# EAGLE design latch_THT_v2 (EAGLE 8.3.1)
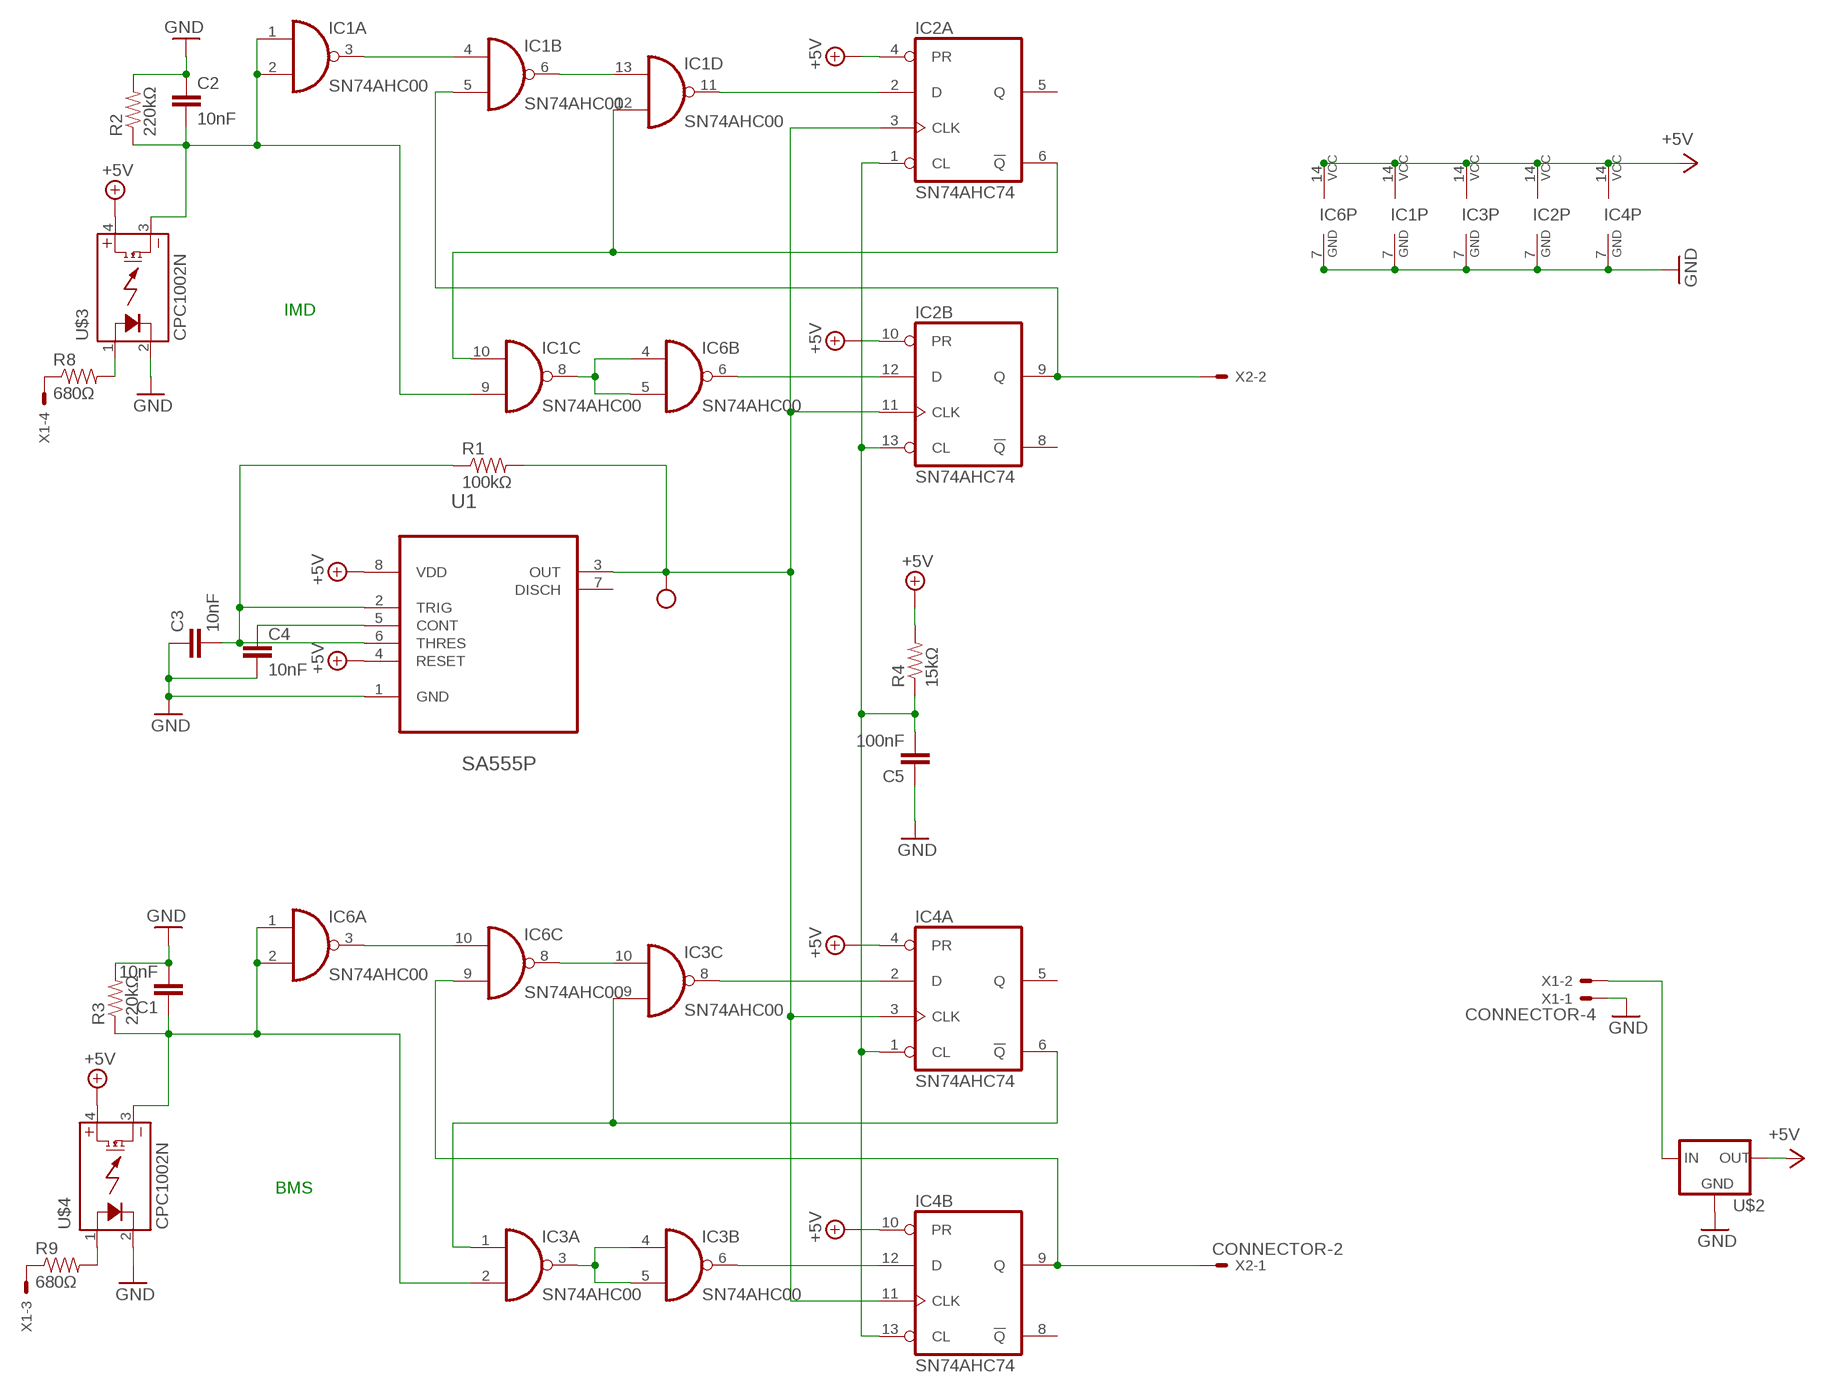
[diagram p0: schematic, sheet 1]

## Parts
C1  10nF  CAP_  [AXIAL-5MM]
C2  10nF  CAP_  [AXIAL-5MM]
C3  10nF  CAP_  [AXIAL-5MM]
C4  10nF  CAP_  [AXIAL-5MM]
C5  100nF  CAP_  [AXIAL-5MM]
IC1  SN74AHC00  [DIL14]
IC2  SN74AHC74  [DIL14]
IC3  SN74AHC00  [DIL14]
IC4  SN74AHC74  [DIL14]
IC6  SN74AHC00  [DIL14]
R1  100kΩ  RESISTORPTH-1/4W  [AXIAL-0.4]
R2  220kΩ  RESISTORPTH-1/4W  [AXIAL-0.4]
R3  220kΩ  RESISTORPTH-1/4W  [AXIAL-0.4]
R4  15kΩ  RESISTORPTH-1/4W  [AXIAL-0.4]
R8  680Ω  RESISTORPTH-1/4W  [AXIAL-0.4]
R9  680Ω  RESISTORPTH-1/4W  [AXIAL-0.4]
U1  SA555P  [DIP254P762X508-8]
U$1  TEST_POINT  [TEST_POINT]
U$2  5VREG_LM340-NLM340T-5.0/NOPB  [TO-220]
U$3  CPC1002N  [SOP04]
U$4  CPC1002N  [SOP04]
X1  CONNECTOR-4  [MINIFIT_5566-4]
X2  CONNECTOR-2  [MINIFIT_5566-2]

## Nets
12V: U$2.1(IN) X1.2
+5V: IC1.14(P:VCC) IC2.4(A:PR) IC2.10(B:PR) IC2.14(P:VCC) IC3.14(P:VCC) IC4.4(A:PR) IC4.10(B:PR) IC4.14(P:VCC) IC6.14(P:VCC) R4.P$2 U1.4(RESET) U1.8(VDD) U$2.3(OUT) U$3.4(DC+) U$4.4(DC+)
BMS_5V: C1.P$1 IC3.2(A:I1) IC6.1(A:I0) IC6.2(A:I1) R3.P$1 U$4.3(DC-)
BMS_IN: R9.P$2 U$4.1(CONTROL+)
BMS_OUT: IC4.9(B:Q) IC6.9(C:I1) X2.1
CLK: IC2.3(A:CLK) IC2.11(B:CLK) IC4.3(A:CLK) IC4.11(B:CLK) R1.P$2 U1.3(OUT) U$1.P$1
GND: C1.P$2 C2.P$1 C3.P$1 C4.P$2 C5.P$1 IC1.7(P:GND) IC2.7(P:GND) IC3.7(P:GND) IC4.7(P:GND) IC6.7(P:GND) R2.P$2 R3.P$2 U1.1(GND) U$2.2(GND) U$3.2(CONTROL-) U$4.2(CONTROL-) X1.1
IMD_5V: C2.P$2 IC1.1(A:I0) IC1.2(A:I1) IC1.9(C:I1) R2.P$1 U$3.3(DC-)
IMD_IN: R8.P$2 U$3.1(CONTROL+)
IMD_OUT: IC1.5(B:I1) IC2.9(B:Q) X2.2
N$1: C5.P$2 IC2.1(A:CL) IC2.13(B:CL) IC4.1(A:CL) IC4.13(B:CL) R4.P$1
N$2: IC1.3(A:O) IC1.4(B:I0)
N$3: C3.P$2 R1.P$1 U1.2(TRIG) U1.6(THRES)
N$4: IC1.6(B:O) IC1.13(D:I0)
N$5: IC1.10(C:I0) IC1.12(D:I1) IC2.6(A:!Q)
N$6: IC1.11(D:O) IC2.2(A:D)
N$7: C4.P$1 U1.5(CONT)
N$8: IC2.12(B:D) IC6.6(B:O)
N$10: IC3.6(B:O) IC4.12(B:D)
N$11: IC1.8(C:O) IC6.4(B:I0) IC6.5(B:I1)
N$20: IC6.3(A:O) IC6.10(C:I0)
N$21: IC3.10(C:I0) IC6.8(C:O)
N$22: IC3.1(A:I0) IC3.9(C:I1) IC4.6(A:!Q)
N$23: IC3.8(C:O) IC4.2(A:D)
N$25: IC3.3(A:O) IC3.4(B:I0) IC3.5(B:I1)
N$32: R8.P$1 X1.4
N$33: R9.P$1 X1.3
Unconnected: IC2.5(A:Q) IC2.8(B:!Q) IC3.11(D:O) IC3.12(D:I1) IC3.13(D:I0) IC4.5(A:Q) IC4.8(B:!Q) IC6.11(D:O) IC6.12(D:I1) IC6.13(D:I0) U1.7(DISCH)

## Notes on the sheet
- IMD
- BMS

## Library data of the parts
C1-C5 = HyTechDevices:CAP: Capacitor Standard 0603 ceramic capacitor, and 0.1" leaded capacitor.
IC1 IC3 IC6 = HyTechDevices:SN74AHC00: TI SN74AHC00 Quadruple 2-input NAND
IC2 IC4 = HyTechDevices:SN74AHC74: TI SN74AHC74 Dual positive edge triggered D-type FLIP FLOP
R1-R4 R8 R9 = HyTechDevices:RESISTOR: Resistor Basic schematic elements and footprints for 0603, 1206, and PTH resistors.
U1 = Texas Instruments:SA555P: PRECISION TIMERS; MPN: SA555P; OC_FARNELL: 1755013; OC_NEWARK: 08F4502; PACKAGE: PDIP-8; SUPPLIER: Texas Instruments
U$1 = HyTechDevices:TEST_POINT: Keystone Electronics Test Point 5005
U$2 = HyTechDevices:5VREG_LM340-N: Voltage Regulator 5v linear voltage regulator Datasheet <http://www.mouser.com/ProductDetail/Texas-Instruments/LM340MPX-50-NOPB/?qs=X1J7HmVL2ZGZwtTFRQ9ItA%3D%3D> MAX current out: 1.5A MAX voltage in: 35V
U$3 U$4 = HyTechDevices:CPC1002N: IXYS Solid State Relay .7A
X1 = HyTechDevices:CONNECTOR-4: Mini-Fit Junior connector 4 pole Source: http://www.molex.com; OC_FARNELL: unknown; OC_NEWARK: unknown
X2 = HyTechDevices:CONNECTOR-2: Mini-Fit Junior connector 2 pole Source: http://www.molex.com; OC_FARNELL: 1822072; OC_NEWARK: unknown

## Net classes
0 default: width 0.406 mm, drill 0.406 mm, clearance 0.406 mm

## Board
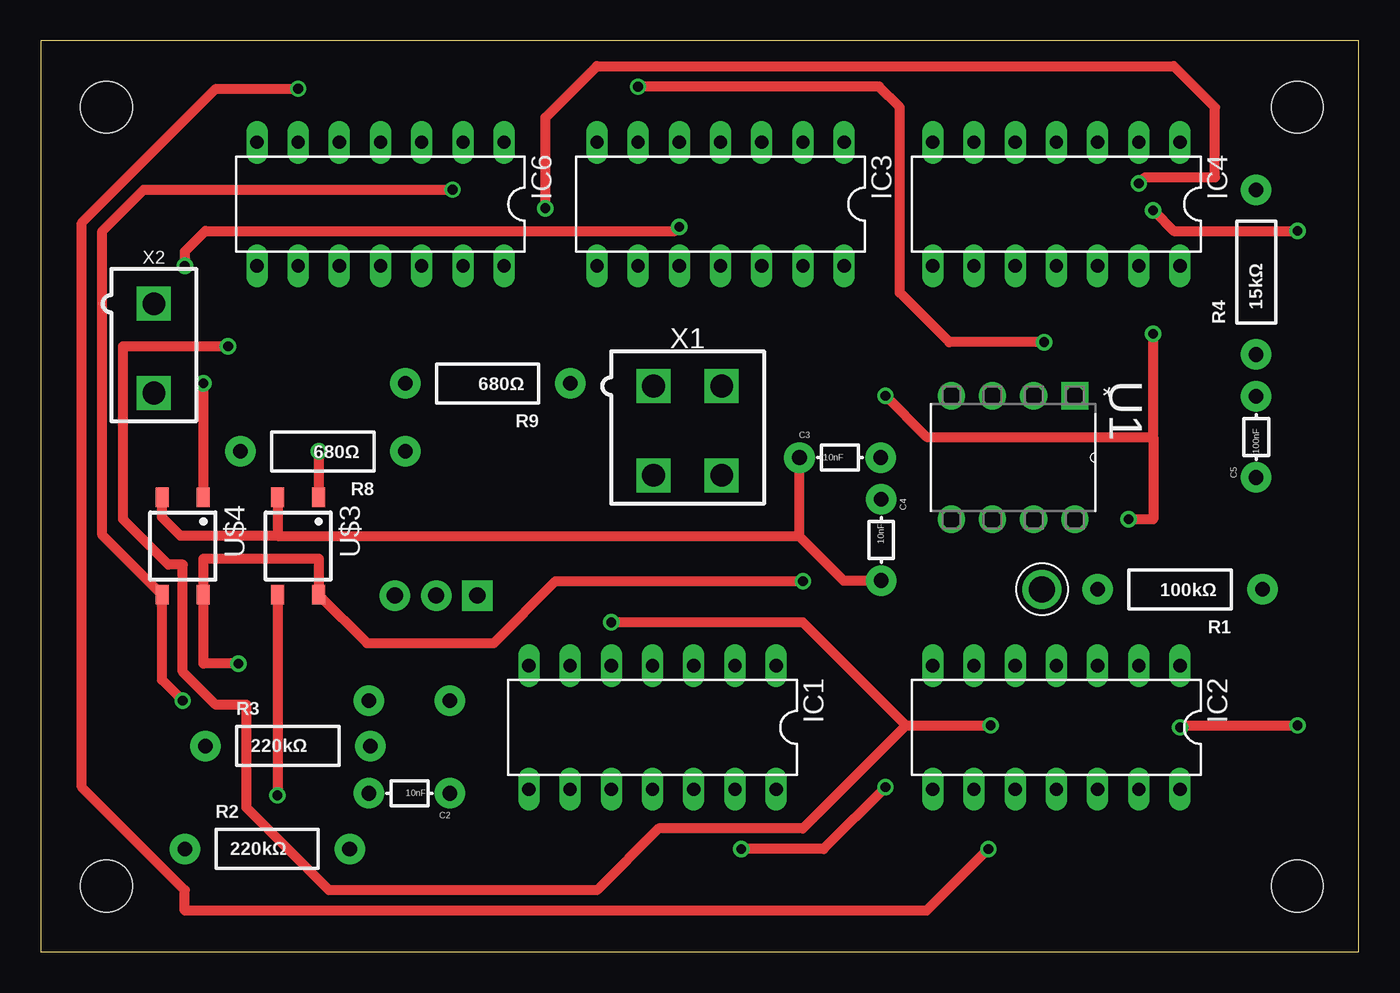
[diagram p1: board, top side]
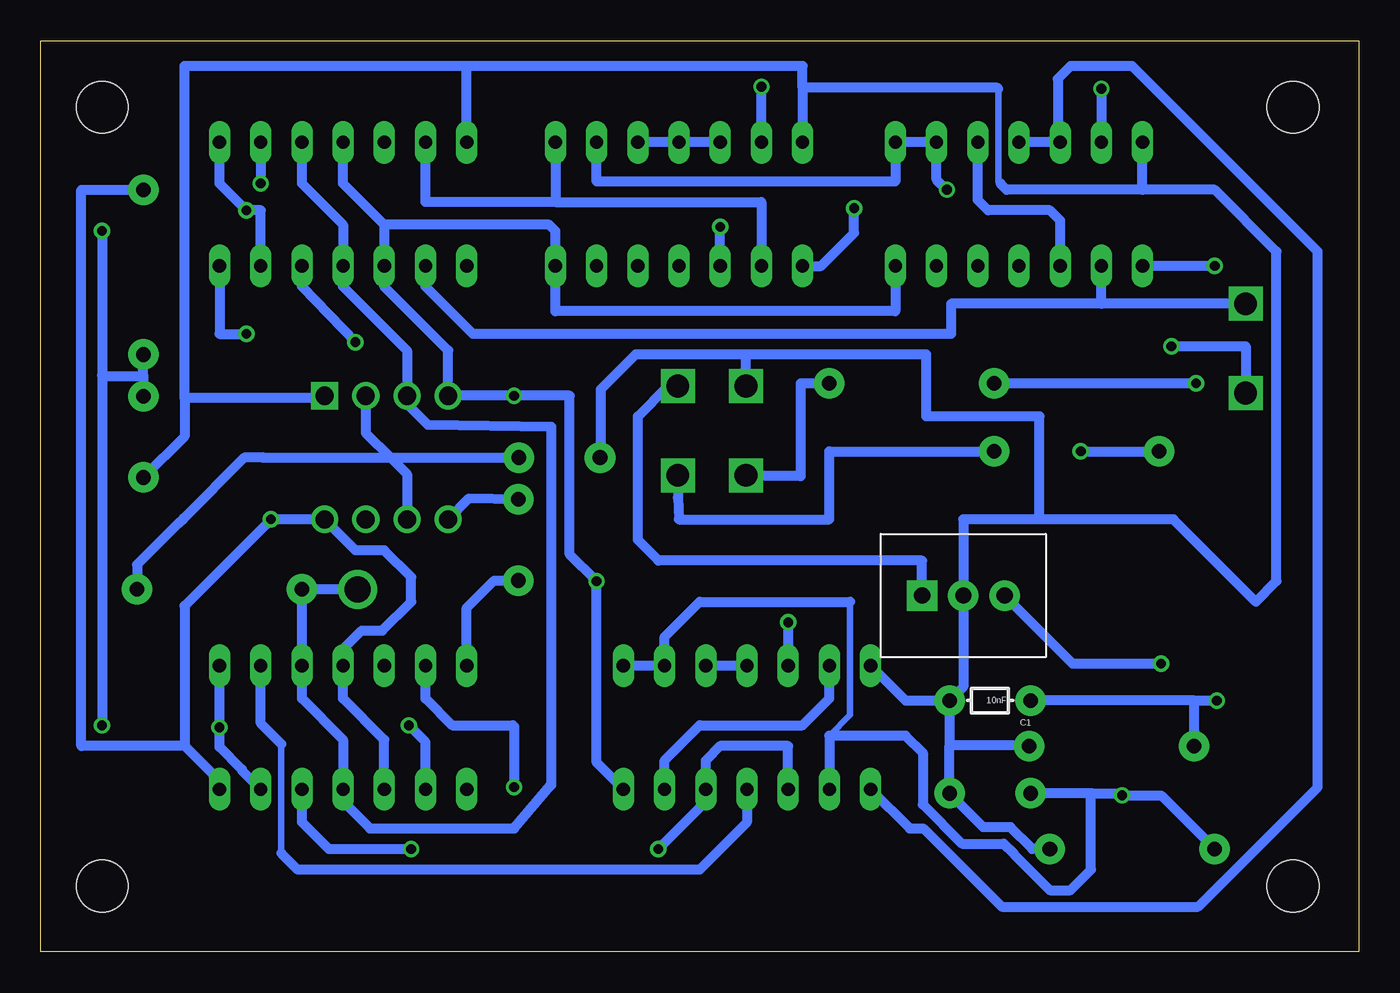
[diagram p2: board, bottom side, seen from below]

Size 81.26 x 56.19 mm. Coordinates in mm from the lower left corner, seen from the top.
Outline: 0,0 81.26,0 81.26,56.19 0,56.19 0,0
Copper layers (1*16): Top 0.035mm / dielectric 1.5mm / Bottom 0.035mm
Design rules "DRC Electronics Lab": minimum track width 16mil, minimum drill 19mil, track to track 16mil, track to pad 12mil, pad to pad 16mil, via to via 16mil, smd to smd 10mil, copper to edge 40mil, drill to drill 10mil, minimum pad ring 10mil, minimum via ring 8mil, stop-mask expansion 4mil, vias tented up to drill 0mil, thermal gap 10mil
Holes 3.17 mm at 4.06,4.06 4.06,52.07 77.47,52.07 77.47,4.06

### Footprints (pad centres in the part's own frame; a part is rotated, then mirrored left to right if it is on the bottom)
AXIAL-5MM = drill 0.9 pad 1.88: P$1 -2.5,0; P$2 2.5,0
DIL14 = drill 0.813 long: 1 -7.62,-3.81; 2 -5.08,-3.81; 3 -2.54,-3.81; 4 0,-3.81; 5 2.54,-3.81; 6 5.08,-3.81; 7 7.62,-3.81; 8 7.62,3.81; 9 5.08,3.81; 10 2.54,3.81; 11 0,3.81; 12 -2.54,3.81; 13 -5.08,3.81; 14 -7.62,3.81
AXIAL-0.4 = drill 0.9 pad 1.88: P$1 -5.08,0; P$2 5.08,0
DIP254P762X508-8 = drill 1.118 square: 1 -7.62,7.62 | drill 1.118: 2 -7.62,5.08; 3 -7.62,2.54; 4 -7.62,0; 5 0,0; 6 0,2.54; 7 0,5.08; 8 0,7.62
TEST_POINT = drill 1.6: P$1 0,0
TO-220 = drill 1 pad 1.88 square: 1 -2.54,0 | drill 1 pad 1.88: 2 0,0; 3 2.54,0
SOP04 = smd 0.8 x 1.2: 1 -1.27,-3; 2 1.27,-3; 3 1.27,3; 4 -1.27,3
MINIFIT_5566-4 = drill 1.4 square: 1 2.1,-2.75; 2 -2.1,-2.75; 3 2.1,2.75; 4 -2.1,2.75
MINIFIT_5566-2 = drill 1.4 square: 1 0,-2.75; 2 0,2.75

### Placement (x,y rotation side)
C1  22.73,15.49 180 bottom
C2  22.73,9.78 180 top
C3  49.28,30.48 0 top
C4  51.82,25.4 270 top
C5  74.93,31.75 90 top
IC1  37.72,13.84 180 top
IC2  62.61,13.84 180 top
IC3  41.91,46.1 180 top
IC4  62.61,46.1 180 top
IC6  20.95,46.1 180 top
R1  70.23,22.35 180 top
R2  13.97,6.35 0 top
R3  15.24,12.7 0 top
R4  74.93,41.91 90 top
R8  17.4,30.86 180 top
R9  27.56,35.05 180 top
U1  56.13,26.67 270 top
U$1  61.72,22.35 0 top
U$2  24.38,21.97 0 bottom
U$3  15.88,25.02 180 top
U$4  8.76,25.02 180 top
X1  39.88,32.13 180 top
X2  6.99,37.21 180 top

### Tracks (layer width: path | path; a pad name or v marks a point on that pad's centre or on a via)
12V
  Bottom 0.61: U$2.1 26.92,24.13 43.18,24.13 44.45,25.4 44.45,33.02 42.59,34.88 X1.2
+5V  (via drill 0.6)
  Top 0.61: v46.99,22.86 31.75,22.86 27.94,19.05 20.11,19.05 U$3.4 17.14,24.26 10.03,24.26 U$4.4 10.03,17.78 v12.19,17.78 | 68.58,31.75 54.61,31.75 v52.07,34.29 | 68.58,31.75 v68.58,38.1 | 68.58,31.75 68.58,26.67 v67.06,26.67
  Bottom 0.61: IC4.4 62.61,47.37 60.07,44.83 | 60.07,44.83 IC4.10 60.07,41.02 56.13,37.08 U1.4 v52.07,34.29 48.64,34.29 48.64,24.51 v46.99,22.86 46.99,11.68 IC1.14 | 70.1,42.16 IC4.14 70.23,38.1 v68.58,38.1 | IC6.14 28.57,39.5 49.53,39.5 IC3.14 49.53,44.45 49.91,44.83 60.07,44.83 | U$2.3 17.65,17.78 v12.19,17.78 | IC2.10 60.07,13.08 62.61,15.62 IC2.4 62.61,18.67 61.47,19.81 60.2,19.81 58.42,21.59 58.42,23.11 60.07,24.77 61.85,24.77 U1.8 v67.06,26.67 72.39,21.34 72.39,12.7 | 72.39,12.7 70.23,10.54 IC2.14 | 72.39,12.7 78.74,12.7 78.74,46.99 R4.P$2
BMS_5V  (via drill 0.6)
  Top 0.61: v25.4,46.99 6.35,46.99 3.81,44.45 3.81,25.7 U$4.3 7.49,16.76 v8.76,15.49
  Bottom 0.61: IC3.2 46.99,47.5 28.57,47.5 IC6.1 IC6.2 26.04,47.62 v25.4,46.99 | 10.17,15.49 C1.P$1 | 10.17,15.49 v8.76,15.49 | R3.P$1 10.16,15.49 10.17,15.49
BMS_IN  (via drill 0.6)
  Top 0.61: v10.03,35.05 U$4.1
  Bottom 0.61: v10.03,35.05 R9.P$2
BMS_OUT
  Bottom 0.61: X2.1 15.88,39.96 | 15.88,39.96 IC6.9 | 15.88,39.96 25.15,39.96 25.15,38.1 54.61,38.1 57.53,41.02 IC4.9
CLK
  Bottom 0.61: IC4.3 65.15,47.37 62.61,44.83 IC4.11 62.61,41.02 58.67,37.08 U1.3 58.67,33.78 57.4,32.51 49.78,32.38 49.78,10.29 52.07,7.62 60.96,7.62 62.61,9.27 IC2.11 62.61,13.08 65.15,15.62 IC2.3 R1.P$2 U$1.P$1
GND
  Top 0.61: U$3.2 14.61,25.65 | 14.61,25.65 46.74,25.65 | 46.74,25.65 arc-90 46.78,25.61 49.49,22.9 C4.P$2 | 46.74,25.65 46.78,25.69 C3.P$1 | 14.61,25.65 8.64,25.65 7.49,26.8 U$4.2
  Bottom 0.406: 22.1,47.37 22.23,47.5 22.23,53.21
  Bottom 0.61: IC4.7 54.99,54.61 | 72.39,34.16 72.39,31.79 C5.P$1 | 72.39,34.16 72.39,54.61 54.99,54.61 | 54.99,54.61 34.29,54.61 34.29,53.27 | IC3.7 34.29,53.27 | C3.P$1 46.74,30.52 46.74,34.67 44.58,36.83 37.6,36.83 | 37.6,36.83 26.67,36.83 26.67,33.02 19.68,33.02 19.68,26.67 | X1.1 37.78,36.65 37.6,36.83 | IC2.7 54.99,21.21 53.3,22.9 C4.P$2 | 22.1,47.37 21.72,46.99 13.34,46.99 | 22.23,53.21 22.28,53.27 34.29,53.27 | 19.68,26.67 24.38,26.67 U$2.2 24.38,16.34 C1.P$2 | 25.23,12.75 C2.P$1 23.15,7.69 21.48,7.69 20.14,6.35 R2.P$2 | C1.P$2 25.23,12.75 | IC1.7 27.94,15.49 C1.P$2 | 19.68,26.67 11.43,26.67 6.35,21.59 5.08,22.86 5.08,43.18 8.89,46.99 13.34,46.99 | 13.34,46.99 IC6.7 | U1.1 63.88,34.16 72.39,34.16 | R3.P$2 20.32,12.75 25.23,12.75
IMD_5V  (via drill 0.6)
  Top 0.61: U$3.3 v14.61,9.65
  Bottom 0.406: 31.37,21.59 31.37,14.61 32.64,13.34
  Bottom 0.61: IC1.1 IC1.2 42.8,19.43 40.64,21.59 31.37,21.59 | IC1.9 32.64,13.34 27.94,13.34 26.88,12.28 26.88,9.1 24.47,6.68 21.9,6.68 21.26,6.04 21.26,6.02 19.05,3.81 17.78,3.81 16.51,5.08 16.51,9.76 16.49,9.78 | R2.P$1 12.19,9.65 v14.61,9.65 14.73,9.78 16.49,9.78 | 16.49,9.78 C2.P$2
IMD_IN  (via drill 0.6)
  Top 0.61: v17.14,30.86 U$3.1
  Bottom 0.61: v17.14,30.86 R8.P$2
IMD_OUT  (via drill 0.6)
  Top 0.61: 53.34,13.97 46.99,20.32 v35.18,20.32 | 53.34,13.97 v58.56,13.97 | 53.34,13.97 46.99,7.62 38.1,7.62 34.29,3.81 17.78,3.81 12.7,8.89 12.7,15.24 10.79,15.24 8.76,17.27 8.76,23.88 7.87,23.88 5.08,26.67 5.08,37.34 v11.56,37.34
  Bottom 0.61: v35.18,20.32 IC1.5 | IC2.9 57.53,12.95 v58.56,13.97 | v11.56,37.34 6.99,37.34 X2.2
N$1  (via drill 0.6)
  Top 0.61: v70.23,13.84 70.36,13.97 v77.47,13.97 | v68.58,45.72 69.85,44.45 v77.47,44.45
  Bottom 0.61: 74.93,35.5 R4.P$1 | 74.93,35.5 C5.P$2 | IC2.13 68.86,11.2 68.86,11.26 70.23,12.63 v70.23,13.84 IC2.1 | 77.47,35.56 v77.47,13.97 | 77.47,35.56 77.41,35.5 74.93,35.5 | IC4.1 70.23,47.37 v68.58,45.72 67.69,45.72 IC4.13 | v77.47,44.45 77.47,35.56
N$2
  Bottom 0.61: IC1.3 IC1.4
N$3
  Bottom 0.61: U1.6 58.67,29.46 59.69,30.48 | U1.2 61.21,32 59.69,30.48 | 67.55,30.48 68.71,30.48 72.45,26.73 72.77,26.42 75.31,23.88 R1.P$1 | 67.55,30.48 59.69,30.48 | 67.56,30.5 67.55,30.48 | 59.69,30.48 C3.P$2
N$4
  Bottom 0.61: IC1.13 42.8,11.81 40.64,13.97 34.29,13.97 32.64,15.62 IC1.6
N$5  (via drill 0.6)
  Top 0.61: v52.07,10.16 48.26,6.35 v43.18,6.35
  Bottom 0.61: IC1.10 35.18,12.7 39.37,12.7 40.26,11.81 IC1.12 40.26,9.27 v43.18,6.35 | v52.07,10.16 52.07,13.89 52.15,13.97 55.88,13.97 57.53,15.62 IC2.6
N$6
  Bottom 0.406: 66.42,6.1 66.42,12.83
  Bottom 0.61: 67.44,13.84 66.42,12.83 | 67.44,13.84 67.69,14.1 | 66.42,6.1 65.41,5.08 40.64,5.08 37.72,8 IC1.11 | 67.44,13.84 67.69,14.1 | 67.69,14.1 IC2.2
N$7
  Bottom 0.61: C4.P$1 54.86,27.94 U1.5
N$8  (via drill 0.6)
  Top 0.61: v58.42,6.35 54.61,2.54 8.89,2.54 8.89,3.81 2.54,10.16 2.54,44.96 10.79,53.21 v15.88,53.21
  Bottom 0.61: v58.42,6.35 63.5,6.35 65.15,8 IC2.12 | v15.88,53.21 IC6.6
N$10  (via drill 0.6)
  Top 0.61: v61.85,37.59 56.01,37.59 52.96,40.64 52.96,52.07 51.69,53.34 v36.83,53.34
  Bottom 0.61: IC4.12 65.15,41.02 v61.85,37.59 | IC3.6 v36.83,53.34
N$11
  Bottom 0.61: 18.56,49.91 IC6.4 | 18.56,49.91 IC6.5 | IC1.8 27.69,7.62 26.85,7.62 22.02,2.79 9.91,2.79 2.54,10.16 2.54,43.18 13.97,54.61 17.78,54.61 18.56,53.83 18.56,49.91
N$20
  Bottom 0.61: IC6.10 18.41,45.09 19.05,45.72 22.86,45.72 23.5,46.35 IC6.3
N$21  (via drill 0.6)
  Top 0.61: v8.89,42.29 8.89,43.18 10.16,44.45 39.12,44.45 v39.37,44.7
  Bottom 0.61: IC3.10 v39.37,44.7 | v8.89,42.29 IC6.8
N$22
  Bottom 0.61: IC3.1 49.53,46.23 | 49.53,46.23 57.53,46.23 IC4.6 | 49.53,46.23 36.83,46.23 IC3.9
N$23  (via drill 0.6)
  Top 0.61: v31.11,45.85 31.11,51.44 34.29,54.61 69.85,54.61 72.39,52.07 72.39,47.75 68.07,47.75 v67.69,47.37
  Bottom 0.61: IC4.2 v67.69,47.37 | IC3.8 33.15,42.29 31.11,44.32 v31.11,45.85
N$25
  Bottom 0.61: IC3.5 IC3.4 IC3.3
N$32
  Bottom 0.61: X1.4 41.98,28.01 41.91,26.67 32.64,26.67 32.64,30.86 R8.P$1
N$33
  Bottom 0.61: R9.P$1 34.42,35.05 34.42,29.34 37.78,29.34 X1.3